# EAGLE design motori5 (EAGLE 5.04)
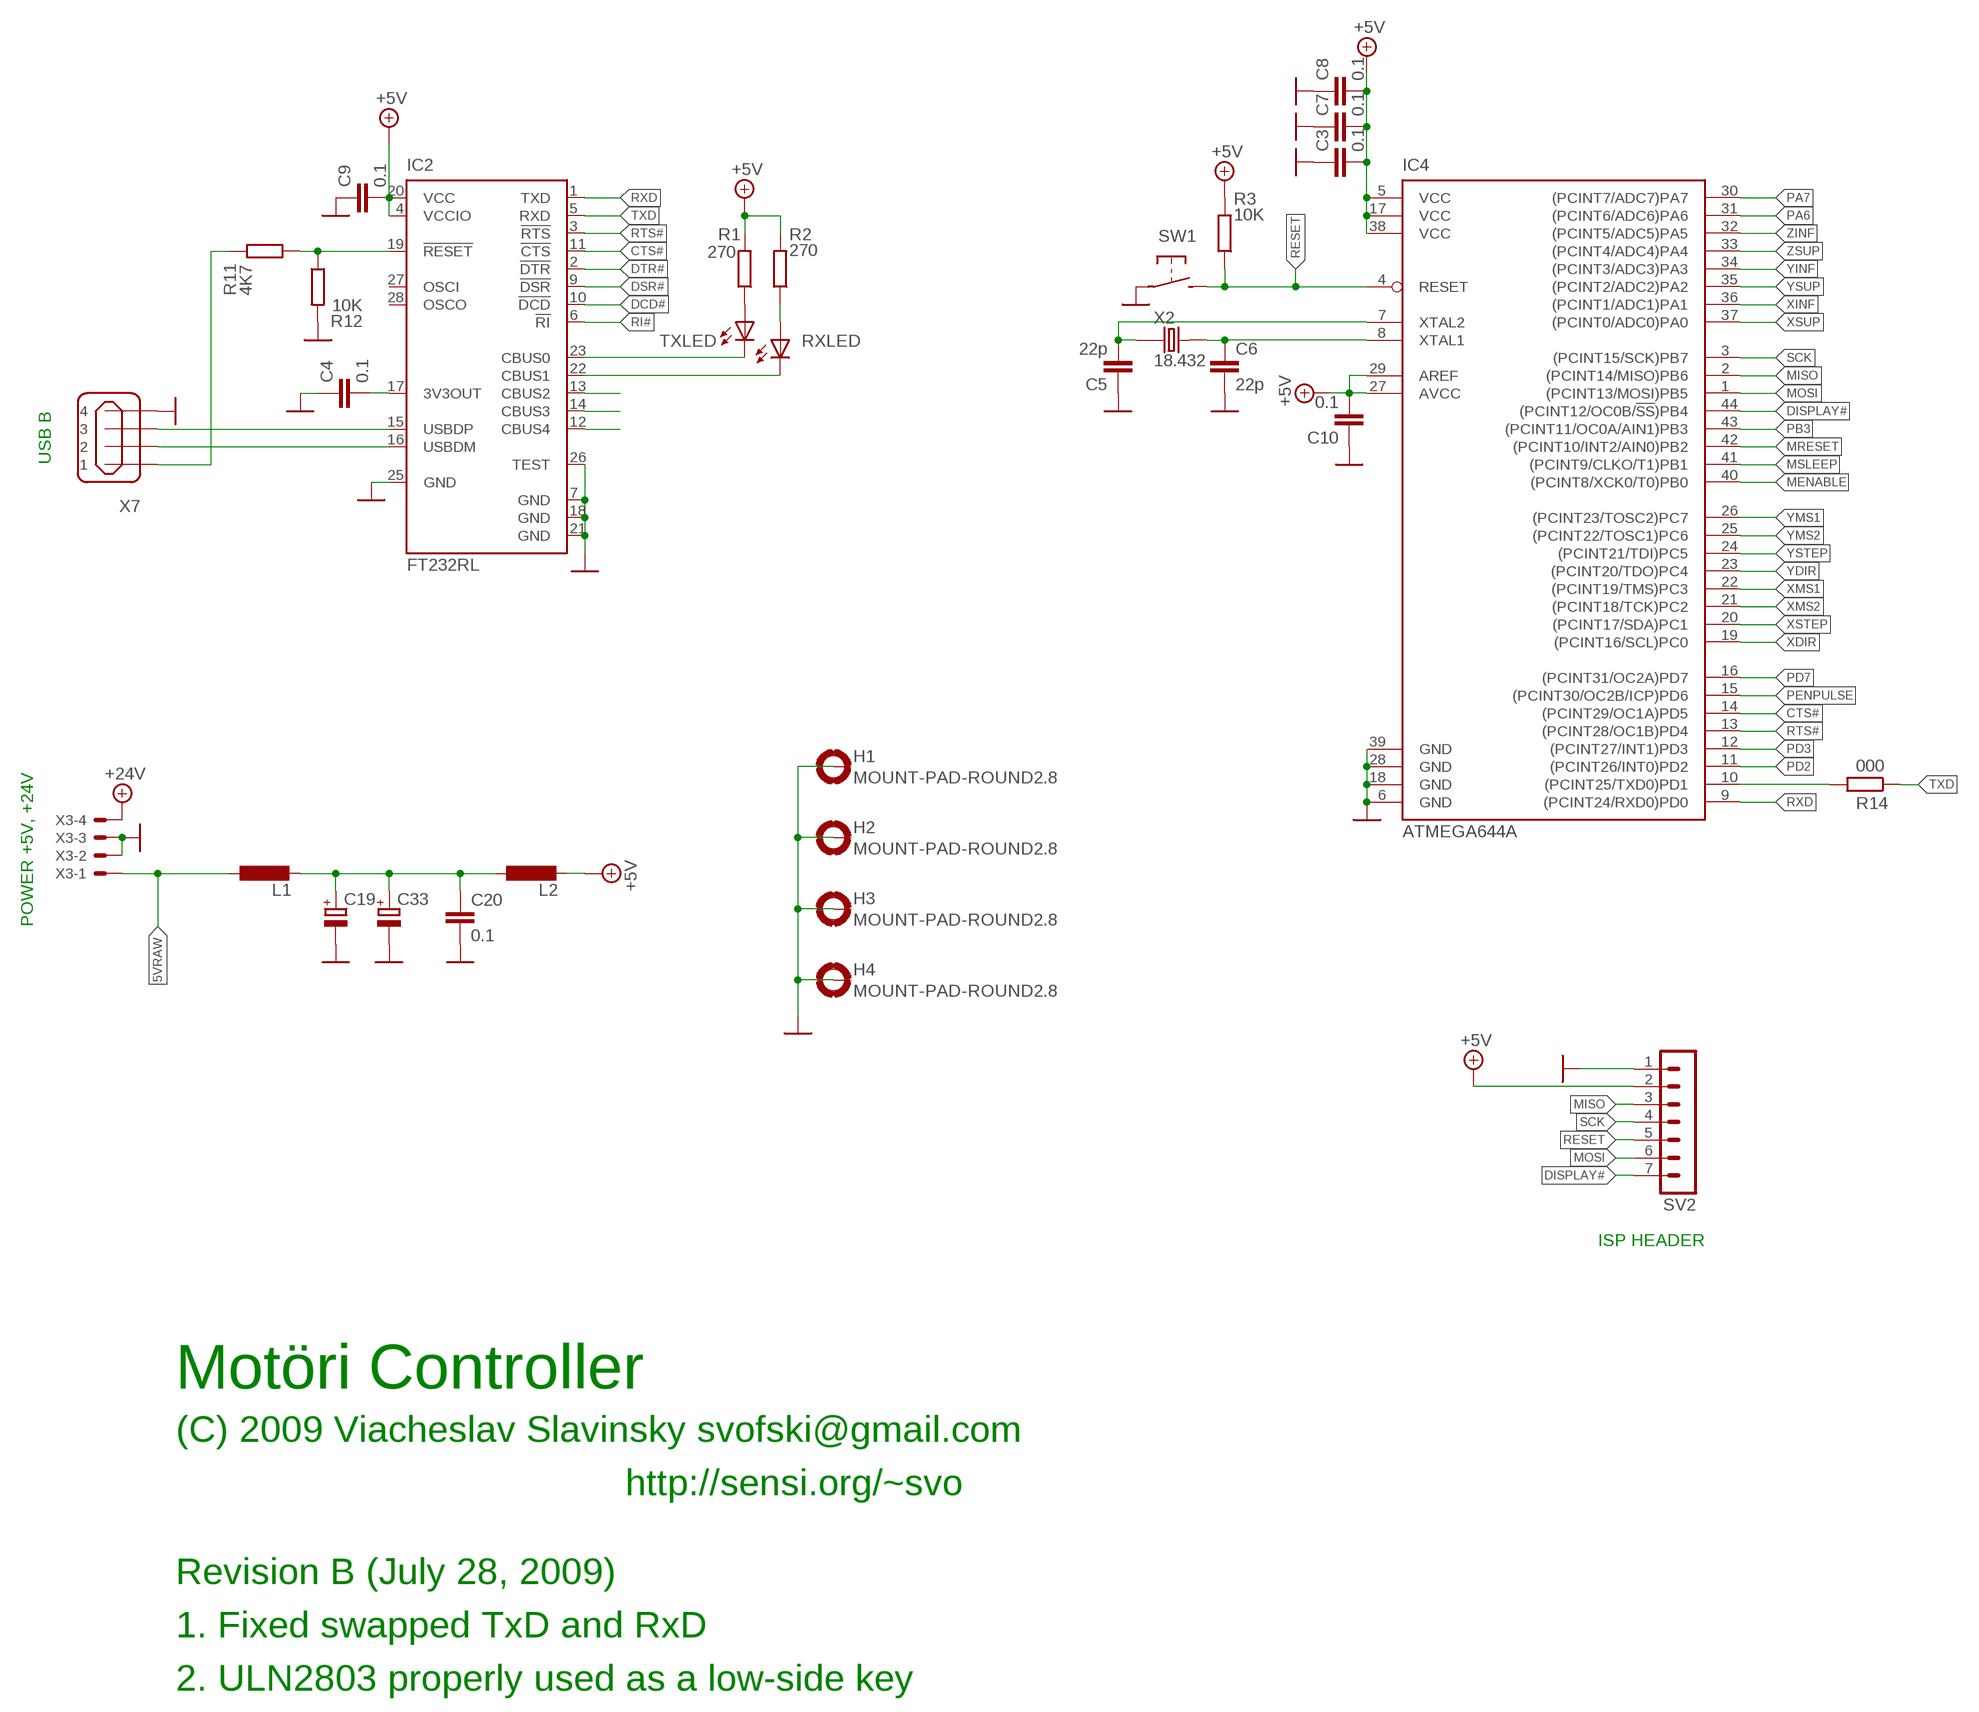
[diagram p0: schematic, sheet 1, part 1 of 2]
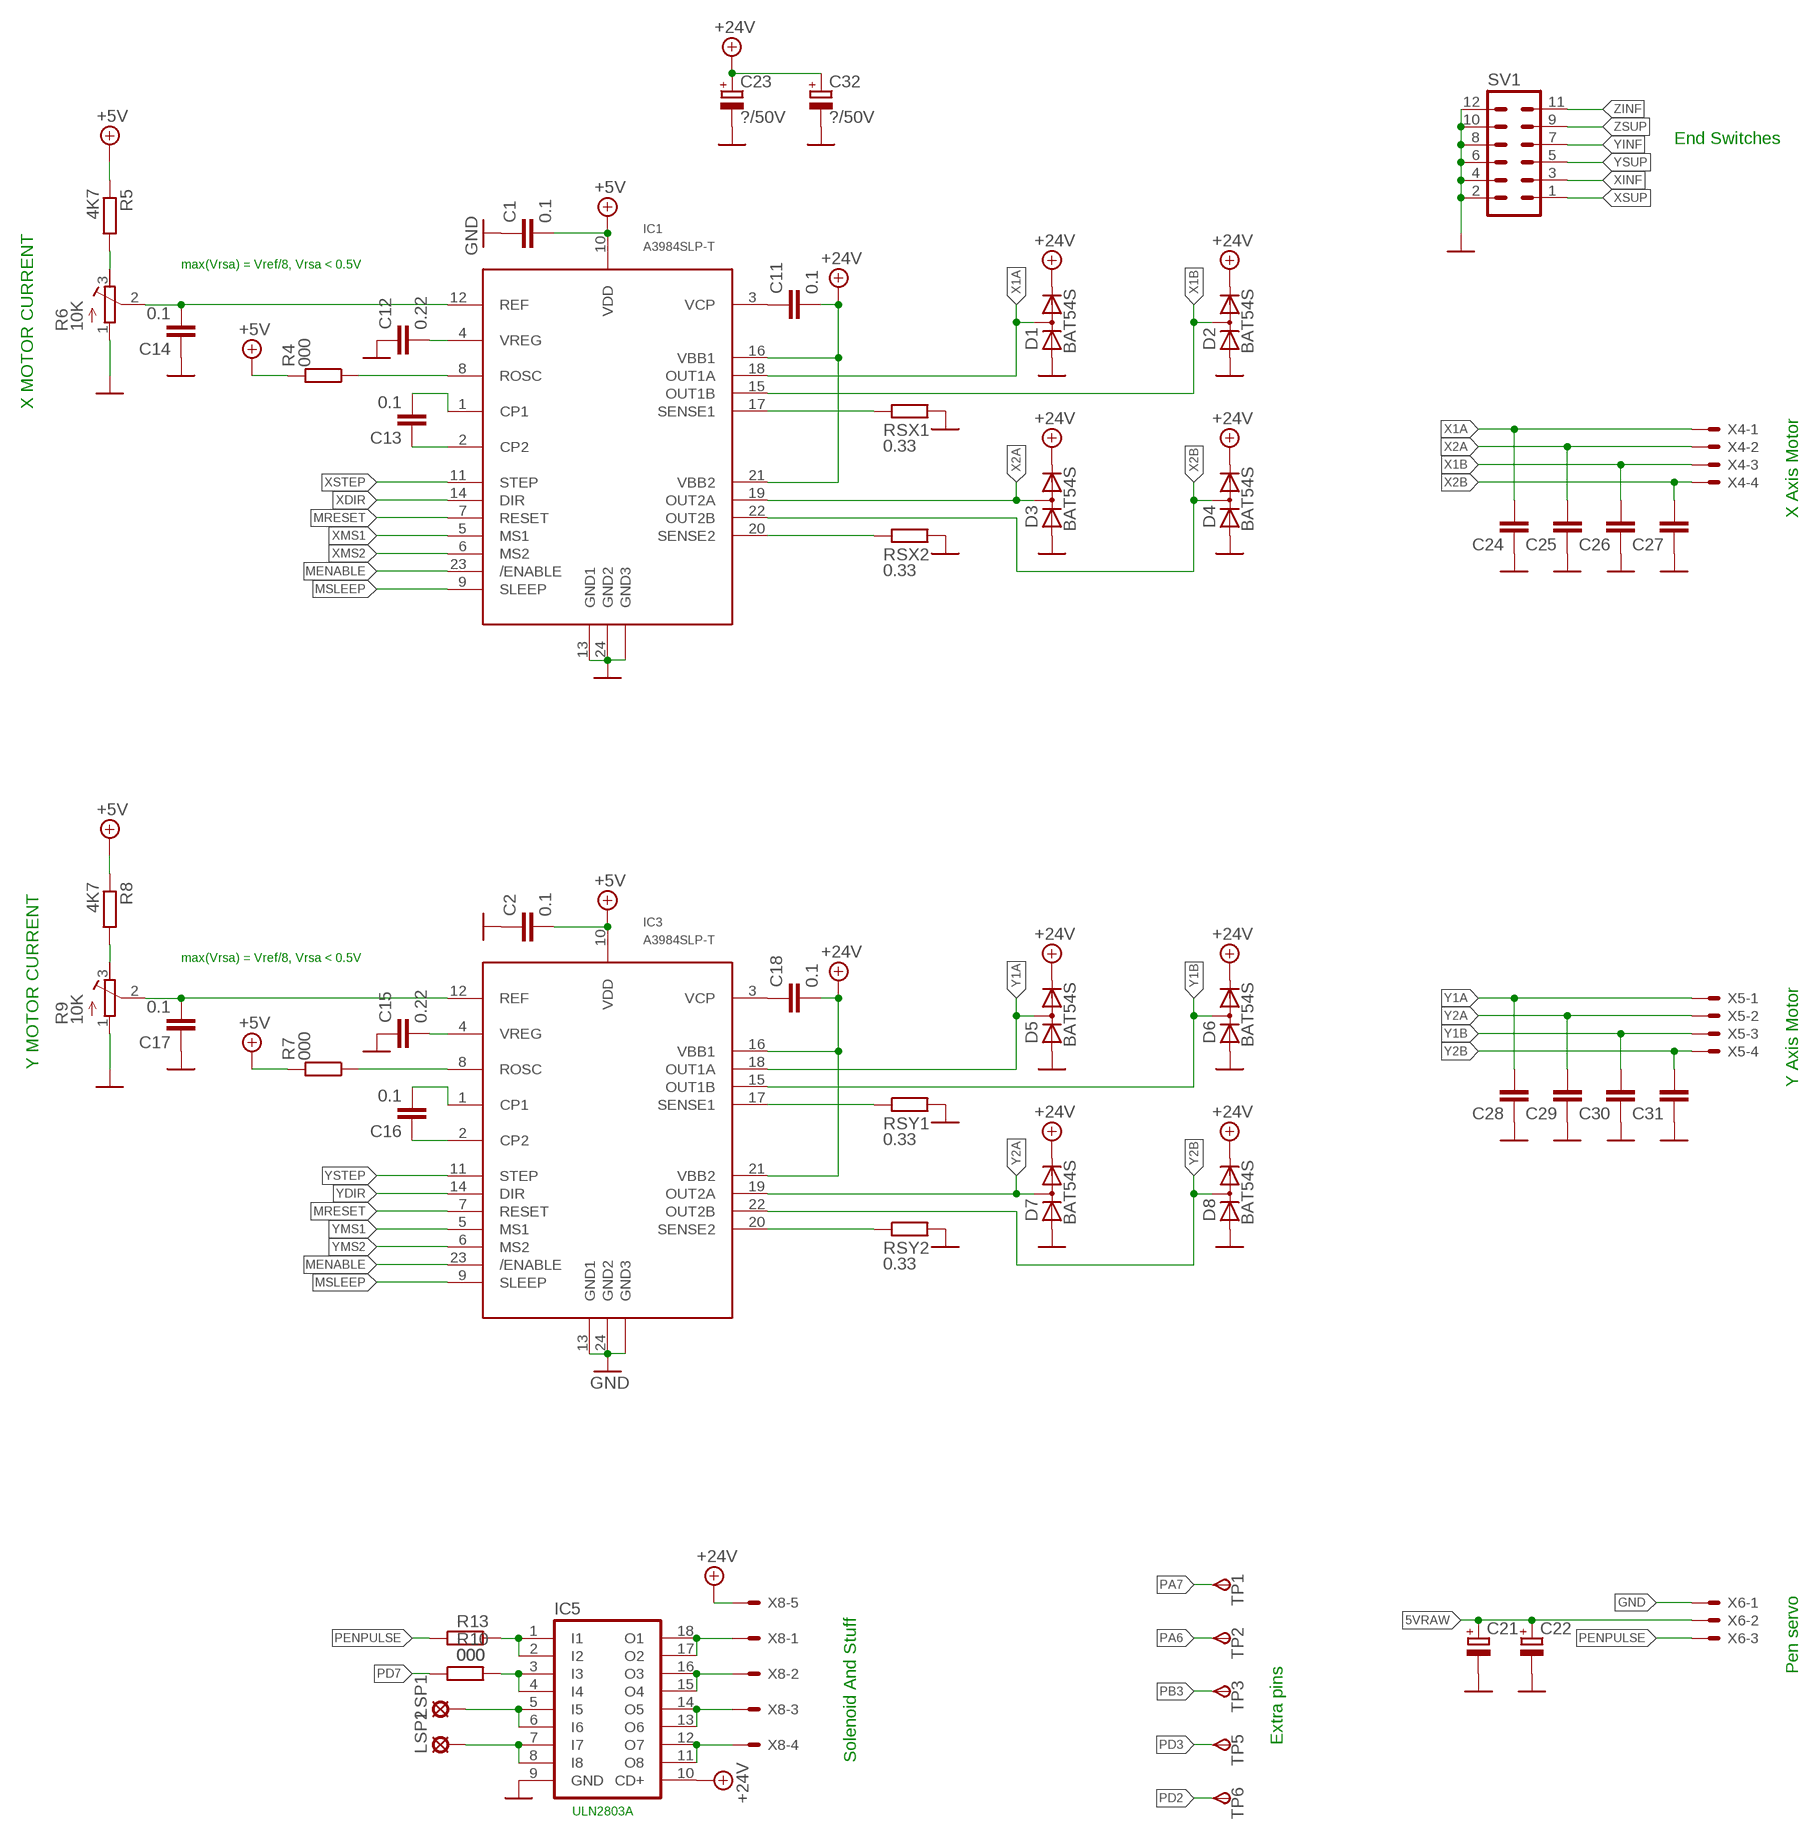
[diagram p1: schematic, sheet 1, part 2 of 2]

## Parts
C1  0.1  C-EUC0603K  [C0603K]
C2  0.1  C-EUC0603K  [C0603K]
C3  0.1  C-EUC0603K  [C0603K]
C4  0.1  C-EUC0603K  [C0603K]
C5  22p  C-EUC0805K  [C0805K]
C6  22p  C-EUC0805K  [C0805K]
C7  0.1  C-EUC0603K  [C0603K]
C8  0.1  C-EUC0603K  [C0603K]
C9  0.1  C-EUC0603K  [C0603K]
C10  0.1  C-EUC0603K  [C0603K]
C11  0.1  C-EUC0805K  [C0805K]
C12  0.22  C-EUC0805K  [C0805K]
C13  0.1  C-EUC0805K  [C0805K]
C14  0.1  C-EUC0603K  [C0603K]
C15  0.22  C-EUC0805K  [C0805K]
C16  0.1  C-EUC0805K  [C0805K]
C17  0.1  C-EUC0603K  [C0603K]
C18  0.1  C-EUC0805K  [C0805K]
C19  CPOL-EUC  [PANASONIC_C]
C20  0.1  C-EUC0603K  [C0603K]
C21  CPOL-EUC  [PANASONIC_C]
C22  CPOL-EUC  [PANASONIC_C]
C23  ?/50V  CPOL-EUTT5D10  [TT5D10]
C24  C-EUC0805K  [C0805K]
C25  C-EUC0805K  [C0805K]
C26  C-EUC0805K  [C0805K]
C27  C-EUC0805K  [C0805K]
C28  C-EUC0805K  [C0805K]
C29  C-EUC0805K  [C0805K]
C30  C-EUC0805K  [C0805K]
C31  C-EUC0805K  [C0805K]
C32  ?/50V  CPOL-EUTT5D10  [TT5D10]
C33  CPOL-EUC  [PANASONIC_C]
D1  BAT54S  DIODE_2CACA-SOT23  [SOT23]
D2  BAT54S  DIODE_2CACA-SOT23  [SOT23]
D3  BAT54S  DIODE_2CACA-SOT23  [SOT23]
D4  BAT54S  DIODE_2CACA-SOT23  [SOT23]
D5  BAT54S  DIODE_2CACA-SOT23  [SOT23]
D6  BAT54S  DIODE_2CACA-SOT23  [SOT23]
D7  BAT54S  DIODE_2CACA-SOT23  [SOT23]
D8  BAT54S  DIODE_2CACA-SOT23  [SOT23]
H1  MOUNT-PAD-ROUND2.8  [2,8-PAD]
H2  MOUNT-PAD-ROUND2.8  [2,8-PAD]
H3  MOUNT-PAD-ROUND2.8  [2,8-PAD]
H4  MOUNT-PAD-ROUND2.8  [2,8-PAD]
IC1  A3984SLP-T  [ETSSOP24]
IC2  FT232RL  [SSOP28]
IC3  A3984SLP-T  [ETSSOP24]
IC4  ATMEGA644A  [TQFP44]
IC5  ULN2803A  [DIL18]
L1  L-EUL5650M  [L5650M]
L2  L-EUL5650M  [L5650M]
LSP1  LSP10  [LSP10]
LSP2  LSP10  [LSP10]
R1  270  R-EU_R0603  [R0603]
R2  270  R-EU_R0603  [R0603]
R3  10K  R-EU_R0805  [R0805]
R4  000  R-EU_R0805  [R0805]
R5  4K7  R-EU_R0805  [R0805]
R6  10K  R-TRIMMCVR42A  [RTRIMCVR42A]
R7  000  R-EU_R0805  [R0805]
R8  4K7  R-EU_R0805  [R0805]
R9  10K  R-TRIMMCVR42A  [RTRIMCVR42A]
R10  000  R-EU_R0805  [R0805]
R11  4K7  R-EU_R0805  [R0805]
R12  10K  R-EU_R0805  [R0805]
R13  000  R-EU_R0805  [R0805]
R14  000  R-EU_R0805  [R0805]
RSX1  0.33  R-EU_R2010  [R2010]
RSX2  0.33  R-EU_R2010  [R2010]
RSY1  0.33  R-EU_R2010  [R2010]
RSY2  0.33  R-EU_R2010  [R2010]
RXLED  LEDCHIPLED_0603  [CHIPLED_0603]
SV1  MA06-2  [MA06-2]
SV2  MA07-1  [MA07-1]
SW1  BUTTON-IT_1181  [SW_IT1181]
TP1  TPSTP10SQ  [TP10SQ]
TP2  TPSTP10SQ  [TP10SQ]
TP3  TPSB2,54  [B2,54]
TP5  TPSTP10SQ  [TP10SQ]
TP6  TPSTP10SQ  [TP10SQ]
TXLED  LEDCHIPLED_1206  [CHIPLED_1206]
X2  18.432  KX-12B  [GEYER_KX-12B]
X3  22-23-2041  [22-23-2041]
X4  22-23-2041  [22-23-2041]
X5  22-23-2041  [22-23-2041]
X6  22-23-2031  [22-23-2031]
X7  MINI-USB_SHIELD4P-85-32004-10X  [85-32004-10X]
X8  22-23-2051  [22-23-2051]

## Nets
5VRAW: C21.+ C22.+ L1.1 X3.1 X6.2
+5V: C1.2 C2.2 C3.2 C7.2 C8.2 C9.2 C10.2 IC1.10(VDD) IC2.4(VCCIO) IC2.20(VCC) IC3.10(VDD) IC4.5(VCC) IC4.17(VCC) IC4.27(AVCC) IC4.29(AREF) IC4.38(VCC) L2.2 R1.2 R2.2 R3.2 R4.2 R5.1 R7.2 R8.1 SV2.2
+24V: C11.2 C18.2 C23.+ C32.+ D1.2(C) D2.2(C) D3.2(C) D4.2(C) D5.2(C) D6.2(C) D7.2(C) D8.2(C) IC1.16(VBB1) IC1.21(VBB2) IC3.16(VBB1) IC3.21(VBB2) IC5.10(CD+) X3.4 X8.5
CTS#: IC2.11(!CTS) IC4.14((PCINT29/OC1A)PD5)
DCD#: IC2.10(!DCD)
DISPLAY#: IC4.44((PCINT12/OC0B/!SS!)PB4) SV2.7
DSR#: IC2.9(!DSR)
DTR#: IC2.2(!DTR)
FTDIRESET: IC2.19(!RESET) R11.1 R12.1
GND: C1.1 C2.1 C3.1 C4.1 C5.1 C6.2 C7.1 C8.1 C9.1 C10.1 C12.1 C14.1 C15.1 C17.1 C19.- C20.2 C21.- C22.- C23.- C24.1 C25.1 C26.1 C27.1 C28.1 C29.1 C30.1 C31.1 C32.- C33.- D1.1(A) D2.1(A) D3.1(A) D4.1(A) D5.1(A) D6.1(A) D7.1(A) D8.1(A) H1.B2,8(MOUNT) H2.B2,8(MOUNT) H3.B2,8(MOUNT) H4.B2,8(MOUNT) IC1.13(GND1) IC1.24(GND2) IC1.THERMALPAD(GND3) IC2.7(GND) IC2.18(GND) IC2.21(GND) IC2.25(GND) IC2.26(TEST) IC3.13(GND1) IC3.24(GND2) IC3.THERMALPAD(GND3) IC4.6(GND) IC4.18(GND) IC4.28(GND) IC4.39(GND) IC5.9(GND) R6.1(E) R9.1(E) R12.2 RSX1.2 RSX2.2 RSY1.2 RSY2.2 SV1.2 SV1.4 SV1.6 SV1.8 SV1.10 SV1.12 SV2.1 SW1.P$1(P1) X3.2 X3.3 X6.1 X7.4
MENABLE: IC1.23(/ENABLE) IC3.23(/ENABLE) IC4.40((PCINT8/XCK0/T0)PB0)
MISO: IC4.2((PCINT14/MISO)PB6) SV2.3
MOSI: IC4.1((PCINT13/MOSI)PB5) SV2.6
MRESET: IC1.7(RESET) IC3.7(RESET) IC4.42((PCINT10/INT2/AIN0)PB2)
MSLEEP: IC1.9(SLEEP) IC3.9(SLEEP) IC4.41((PCINT9/CLKO/T1)PB1)
N$1: IC2.22(CBUS1) RXLED.C
N$2: R1.1 TXLED.A
N$3: R2.1 RXLED.A
N$4: C6.1 IC4.8(XTAL1) X2.P$2
N$7: C4.2 IC2.17(3V3OUT)
N$8: C5.2 IC4.7(XTAL2) X2.P$1
N$10: C11.1 IC1.3(VCP)
N$11: R5.2 R6.3(A)
N$12: C12.2 IC1.4(VREG)
N$13: IC2.23(CBUS0) TXLED.C
N$14: IC1.8(ROSC) R4.1
N$15: C13.1 IC1.2(CP2)
N$16: C13.2 IC1.1(CP1)
N$17: IC4.10((PCINT25/TXD0)PD1) R14.2
N$18: IC1.17(SENSE1) RSX1.1
N$19: IC1.20(SENSE2) RSX2.1
N$20: C15.2 IC3.4(VREG)
N$21: IC3.8(ROSC) R7.1
N$22: C16.1 IC3.2(CP2)
N$23: C16.2 IC3.1(CP1)
N$25: R8.2 R9.3(A)
N$26: IC3.17(SENSE1) RSY1.1
N$27: IC3.20(SENSE2) RSY2.1
N$28: C18.1 IC3.3(VCP)
N$29: C19.+ C20.1 C33.+ L1.2 L2.1
N$41: IC5.17(O2) IC5.18(O1) X8.1
N$42: R11.2 X7.1
N$43: IC5.15(O4) IC5.16(O3) X8.2
N$44: IC5.13(O6) IC5.14(O5) X8.3
N$45: IC5.11(O8) IC5.12(O7) X8.4
N$46: IC5.1(I1) IC5.2(I2) R13.2
N$47: IC5.3(I3) IC5.4(I4) R10.2
N$48: IC5.5(I5) IC5.6(I6) LSP1.MP
N$49: IC5.7(I7) IC5.8(I8) LSP2.MP
PA6: IC4.31((PCINT6/ADC6)PA6) TP2.TP(PP)
PA7: IC4.30((PCINT7/ADC7)PA7) TP1.TP(PP)
PB3: IC4.43((PCINT11/OC0A/AIN1)PB3) TP3.PP
PD2: IC4.11((PCINT26/INT0)PD2) TP6.TP(PP)
PD3: IC4.12((PCINT27/INT1)PD3) TP5.TP(PP)
PD7: IC4.16((PCINT31/OC2A)PD7) R10.1
PENPULSE: IC4.15((PCINT30/OC2B/ICP)PD6) R13.1 X6.3
PWREN#: IC2.14(CBUS3)
RESET: IC4.4(RESET) R3.1 SV2.5 SW1.P$2(P2)
RI#: IC2.6(!RI)
RTS#: IC2.3(!RTS) IC4.13((PCINT28/OC1B)PD4)
RXD: IC2.1(TXD) IC4.9((PCINT24/RXD0)PD0)
SCK: IC4.3((PCINT15/SCK)PB7) SV2.4
SLEEP#: IC2.12(CBUS4)
TXD: IC2.5(RXD) R14.1
TXDEN: IC2.13(CBUS2)
U+: IC2.15(USBDP) X7.3
U-: IC2.16(USBDM) X7.2
VREFX: C14.2 IC1.12(REF) R6.2(S)
VREFY: C17.2 IC3.12(REF) R9.2(S)
X1A: C24.2 D1.3(AC) IC1.18(OUT1A) X4.1
X1B: C26.2 D2.3(AC) IC1.15(OUT1B) X4.3
X2A: C25.2 D3.3(AC) IC1.19(OUT2A) X4.2
X2B: C27.2 D4.3(AC) IC1.22(OUT2B) X4.4
XDIR: IC1.14(DIR) IC4.19((PCINT16/SCL)PC0)
XINF: IC4.36((PCINT1/ADC1)PA1) SV1.3
XMS1: IC1.5(MS1) IC4.22((PCINT19/TMS)PC3)
XMS2: IC1.6(MS2) IC4.21((PCINT18/TCK)PC2)
XSTEP: IC1.11(STEP) IC4.20((PCINT17/SDA)PC1)
XSUP: IC4.37((PCINT0/ADC0)PA0) SV1.1
Y1A: C28.2 D5.3(AC) IC3.18(OUT1A) X5.1
Y1B: C30.2 D6.3(AC) IC3.15(OUT1B) X5.3
Y2A: C29.2 D7.3(AC) IC3.19(OUT2A) X5.2
Y2B: C31.2 D8.3(AC) IC3.22(OUT2B) X5.4
YDIR: IC3.14(DIR) IC4.23((PCINT20/TDO)PC4)
YINF: IC4.34((PCINT3/ADC3)PA3) SV1.7
YMS1: IC3.5(MS1) IC4.26((PCINT23/TOSC2)PC7)
YMS2: IC3.6(MS2) IC4.25((PCINT22/TOSC1)PC6)
YSTEP: IC3.11(STEP) IC4.24((PCINT21/TDI)PC5)
YSUP: IC4.35((PCINT2/ADC2)PA2) SV1.5
ZINF: IC4.32((PCINT5/ADC5)PA5) SV1.11
ZSUP: IC4.33((PCINT4/ADC4)PA4) SV1.9
Unconnected: IC2.27(OSCI) IC2.28(OSCO) X7.M1(S1) X7.M2(S2)

## Notes on the sheet
- End Switches
- X MOTOR CURRENT
- max(Vrsa) = Vref/8, Vrsa < 0.5V
- X Axis Motor
- USB B
- max(Vrsa) = Vref/8, Vrsa < 0.5V
- POWER +5V, +24V
- Y MOTOR CURRENT
- Y Axis Motor
- ISP HEADER
- Motöri Controller
- (C) 2009 Viacheslav Slavinsky svofski@gmail.com
- http://sensi.org/~svo
- Pen servo
- Revision B (July 28, 2009)
- 1. Fixed swapped TxD and RxD | Extra pins
- Solenoid And Stuff
- 2. ULN2803 properly used as a low-side key
- ULN2803A

## Library data of the parts
C1-C18 C20 C24-C31 = rcl:C-EU: CAPACITOR, European symbol
C19 C21-C23 C32 C33 = rcl:CPOL-EU: POLARIZED CAPACITOR, European symbol
D1-D8 = diode:DIODE_2CACA-: 2 Diodes - Cathode-Anode|Cathode-Anode
H1-H4 = holes:MOUNT-PAD-ROUND: MOUNTING PAD, round
IC1 IC3 = 0-allegro-a3984:A3984*: DMOS Microstepping Driver with Translator
IC2 = ftdichip:FT232R: Source: http://www.ftdichip.com/Documents/DataSheets/DS_FT232R_v104.pdf
IC4 = atmel:ATMEGA644: 8-bit Microcontroller with 64K Bytes In-System Programmable Flash Source: http://www.atmel.com/dyn/resources/prod_documents/doc2593.pdf
IC5 = uln-udn:ULN2803A: DRIVER ARRAY
L1 L2 = rcl:L-EU: INDUCTOR, European symbol
LSP1 LSP2 = solpad:LSP10: SOLDER PAD drill 1.0 mm, distributor Buerklin, 12H555
R1-R5 R7 R8 R10-R14 RSX1 RSX2 RSY1 RSY2 = rcl:R-EU_: RESISTOR, European symbol
R6 R9 = rcl:R-TRIMM: Trimm resistor
RXLED TXLED = led:LED: LED OSRAM: - CHIPLED LG R971, LG N971, LY N971, LG Q971, LY Q971, LO R971, LY R971 LH N974, LH R974 LS Q976, LO Q976, LY Q976 LO Q996 - Hyper CHIPLED LW Q18S LB Q993, LB Q99A, LB R99A - SideLED LS A670, LO A670, LY A670, LG A670, LP A670 LB A673, LV A673, LT A673, LW A673 LH A674 LY A675 LS A676, LA A676, LO A676, LY A676, LW A676 LS A679, LY A679, LG A679 - Hyper Micro SIDELED® LS Y876, LA Y876, LO Y876, LY Y876 LT Y87S - SmartLED LW L88C, LW L88S LB L89C, LB L89S, LG L890 LS L89K, LO L89K, LY L89K LS L896, LA L896, LO L896, LY L896 - TOPLED LS T670, LO T670, LY T670, LG T670, LP T670 LSG T670, LSP T670, LSY T670, LOP T670, LYG T670 LG T671, LOG T671, LSG T671 LB T673, LV T673, LT T673, LW T673 LH T674 LS T676, LA T676, LO T676, LY T676, LB T676, LH T676, LSB T676, LW T676 LB T67C, LV T67C, LT T67C, LS T67K, LO T67K, LY T67K, LW E67C LS E67B, LA E67B, LO E67B, LY E67B, LB E67C, LV E67C, LT E67C LW T67C LS T679, LY T679, LG T679 LS T770, LO T770, LY T770, LG T770, LP T770 LB T773, LV T773, LT T773, LW T773 LH T774 LS E675, LA E675, LY E675, LS T675 LS T776, LA T776, LO T776, LY T776, LB T776 LHGB T686 LT T68C, LB T68C - Hyper Mini TOPLED® LB M676 - Mini TOPLED Santana® LG M470 LS M47K, LO M47K, LY M47K Source: http://www.osram.convergy.de LUXEON: - LUMILED® LXK2-PW12-R00, LXK2-PW12-S00, LXK2-PW14-U00, LXK2-PW14-V00 LXK2-PM12-R00, LXK2-PM12-S00, LXK2-PM14-U00 LXK2-PE12-Q00, LXK2-PE12-R00, LXK2-PE12-S00, LXK2-PE14-T00, LXK2-PE14-U00 LXK2-PB12-K00, LXK2-PB12-L00, LXK2-PB12-M00, LXK2-PB14-N00, LXK2-PB14-P00, LXK2-PB14-Q00 LXK2-PR12-L00, LXK2-PR12-M00, LXK2-PR14-Q00, LXK2-PR14-R00 LXK2-PD12-Q00, LXK2-PD12-R00, LXK2-PD12-S00 LXK2-PH12-R00, LXK2-PH12-S00 LXK2-PL12-P00, LXK2-PL12-Q00, LXK2-PL12-R00 Source: www.luxeon.com KINGBRIGHT: KA-3528ASYC Source: www.kingbright.com
SV1 = con-lstb:MA06-2: PIN HEADER
SV2 = con-lstb:MA07-1: PIN HEADER
SW1 = 0-svo:BUTTON-IT_1181
TP1-TP3 TP5 TP6 = 0-svo:TPS: TEST PIN
X2 = 0-svo:KX-12B: GEYER SMD Quartz Crystals
X3-X5 = con-molex:22-23-2041: .100" (2.54mm) Center Header - 4 Pin
X6 = con-molex:22-23-2031: .100" (2.54mm) Center Header - 3 Pin
X7 = con-cypressindustries:MINI-USB_SHIELD4P-: MINI USB 4 Pol. Source: www.cypressindustries.com
X8 = con-molex:22-23-2051: .100" (2.54mm) Center Header - 5 Pin

## Board
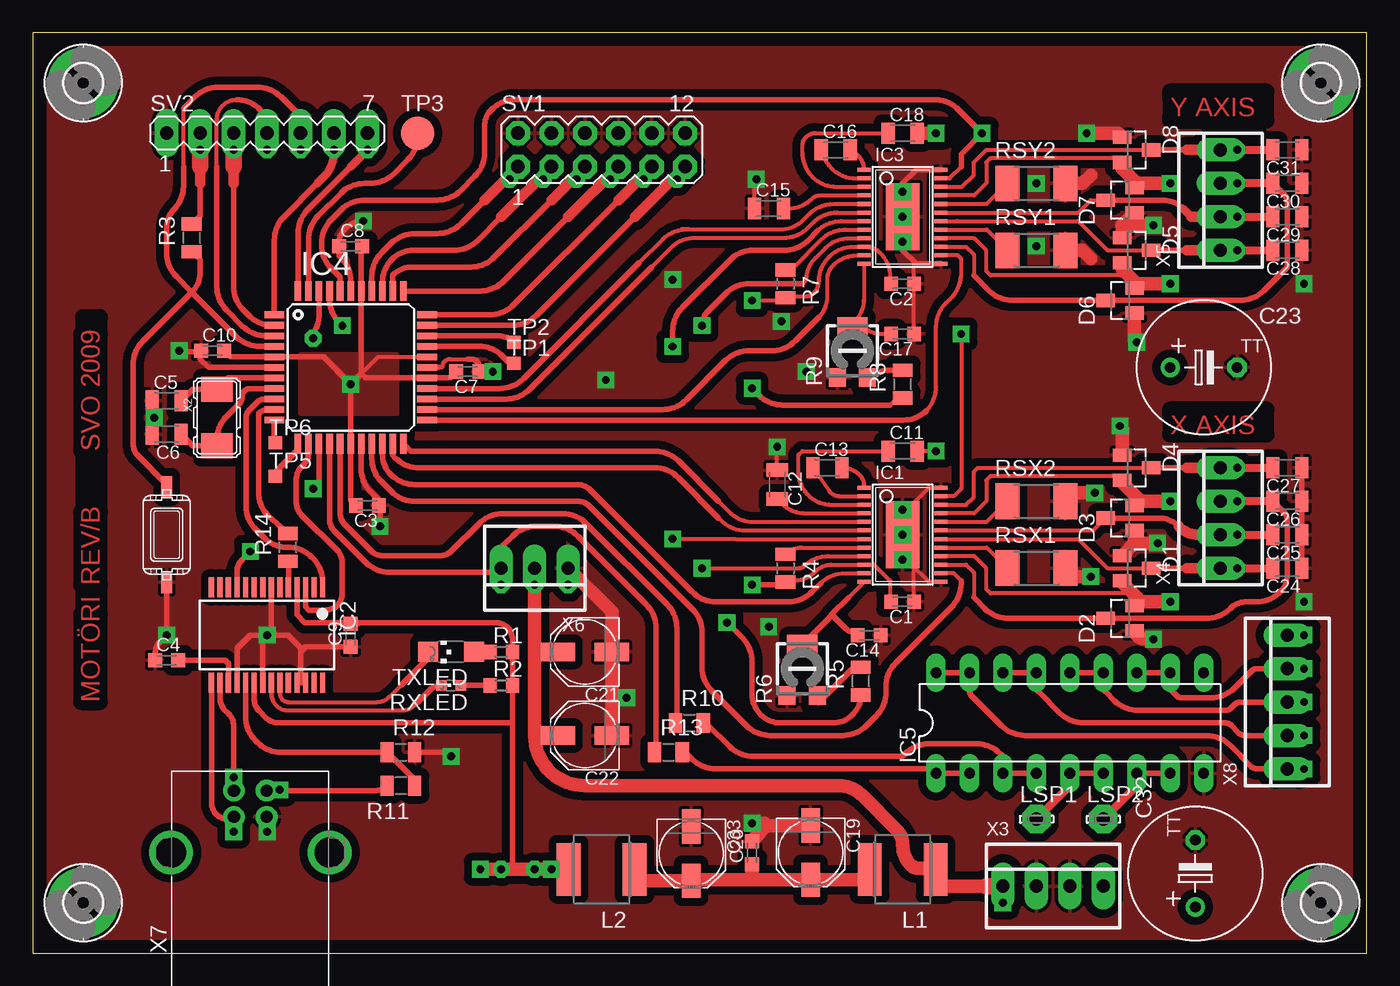
[diagram p2: board, top side]
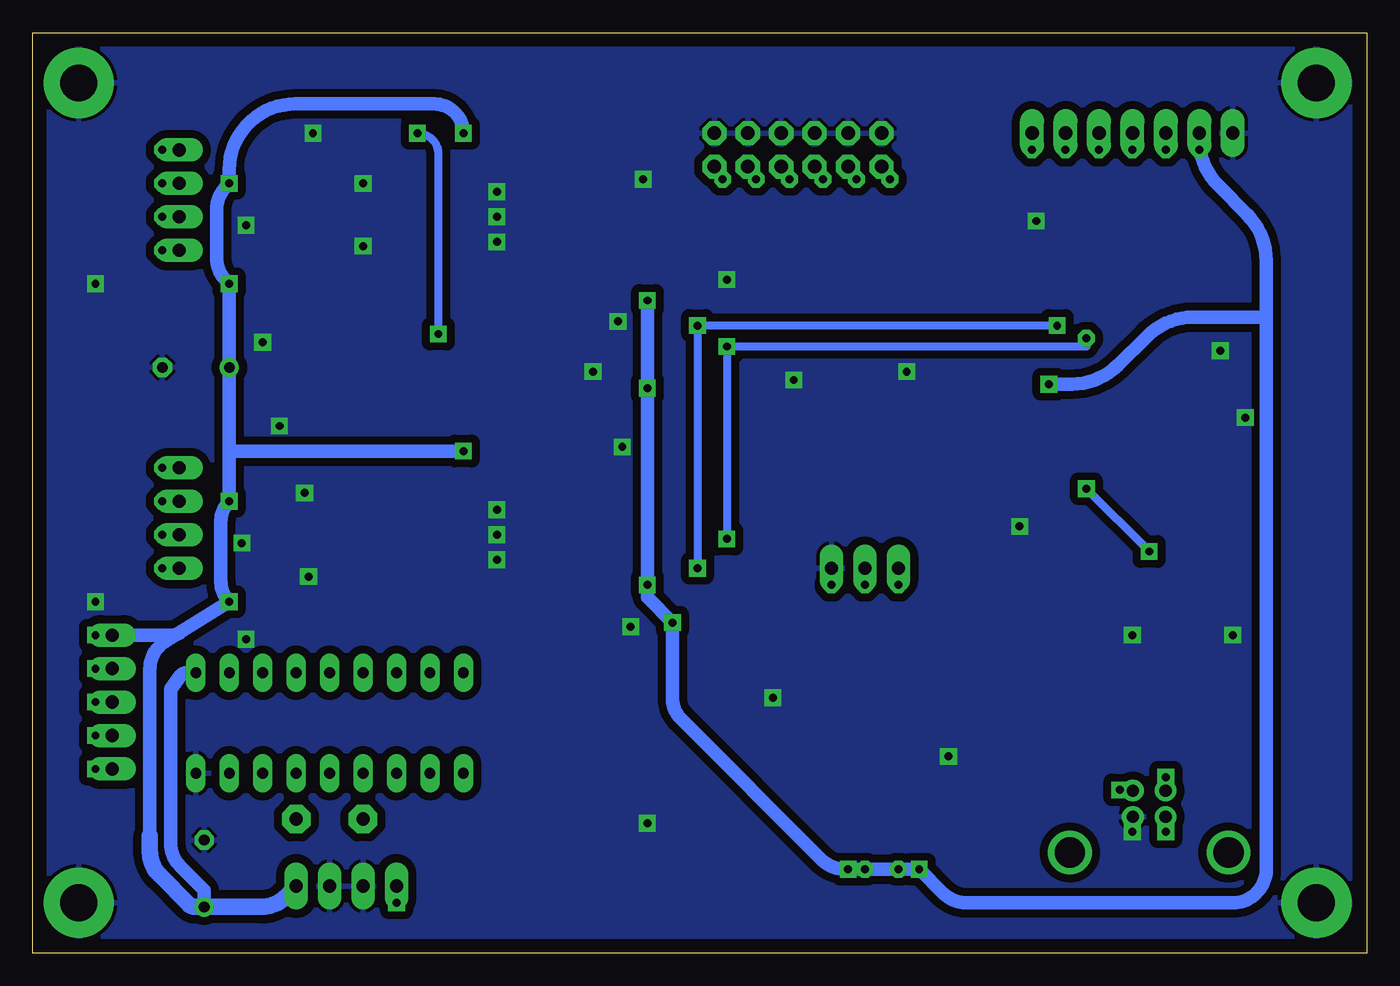
[diagram p3: board, bottom side, seen from below]

Size 101.27 x 69.84 mm. Coordinates in mm from the lower left corner, seen from the top.
Outline: 0,0 101.27,0 101.27,69.84 0,69.84 0,0
Copper layers (1*16): Top 0.035mm / dielectric 1.5mm / Bottom 0.035mm
Design rules "default *": minimum track width 10mil, minimum drill 24mil, track to track 8mil, track to pad 8mil, pad to pad 8mil, via to via 8mil, smd to smd 8mil, copper to edge 40mil, drill to drill 8mil, minimum pad ring 10mil, minimum via ring 8mil, stop-mask expansion 4mil, vias tented up to drill 0mil, thermal gap 10mil
tRestrict: area 86.4,39.4 to 93.7,41.3; area 86.4,63.2 to 93.7,65.4; area 3.8,19.1 to 5.1,48.3; area 61,44.4 to 63.5,45.7; area 57.2,20.3 to 59.7,21.6

### Footprints (pad centres in the part's own frame; a part is rotated, then mirrored left to right if it is on the bottom)
C0603K = smd 1.05 x 1.08: 1 -0.875,0; 2 0.875,0
C0805K = smd 1 x 1.6: 1 -1.1,0; 2 1.1,0
PANASONIC_C = smd 2.6 x 1.4: + 2.05,0; - -2.05,0
TT5D10 = drill 0.813 round: + -2.54,0 | drill 0.813 octagon: - 2.54,0
SOT23 = smd 1 x 1.4: 1 -0.95,-1.1; 2 0.95,-1.1; 3 0,1.1
2,8-PAD = drill 2.8 pad 5.334 round: B2,8 0,0
ETSSOP24 = smd 0.305 x 0.991: 1 -3.575,-2.918; 2 -2.925,-2.918; 3 -2.275,-2.918; 4 -1.625,-2.918; 5 -0.975,-2.918; 6 -0.325,-2.918; 7 0.325,-2.918; 8 0.975,-2.918; 9 1.625,-2.918; 10 2.275,-2.918; 11 2.925,-2.918; 12 3.575,-2.918; 13 3.575,2.918; 14 2.925,2.918; 15 2.275,2.918; 16 1.625,2.918; 17 0.975,2.918; 18 0.325,2.918; 19 -0.325,2.918; 20 -0.975,2.918; 21 -1.625,2.918; 22 -2.275,2.918; 23 -2.925,2.918; 24 -3.575,2.918 | smd 5.08 x 2.54: THERMALPAD 0,0
SSOP28 = smd 0.4 x 1.5: 1 -4.225,-3.625; 2 -3.575,-3.625; 3 -2.925,-3.625; 4 -2.275,-3.625; 5 -1.625,-3.625; 6 -0.975,-3.625; 7 -0.325,-3.625; 8 0.325,-3.625; 9 0.975,-3.625; 10 1.625,-3.625; 11 2.275,-3.625; 12 2.925,-3.625; 13 3.575,-3.625; 14 4.225,-3.625; 15 4.225,3.625; 16 3.575,3.625; 17 2.925,3.625; 18 2.275,3.625; 19 1.625,3.625; 20 0.975,3.625; 21 0.325,3.625; 22 -0.325,3.625; 23 -0.975,3.625; 24 -1.625,3.625; 25 -2.275,3.625; 26 -2.925,3.625; 27 -3.575,3.625; 28 -4.225,3.625
TQFP44 = smd 1.5 x 0.5: 1 -5.8,4; 2 -5.8,3.2; 3 -5.8,2.4; 4 -5.8,1.6; 5 -5.8,0.8; 6 -5.8,0; 7 -5.8,-0.8; 8 -5.8,-1.6; 9 -5.8,-2.4; 10 -5.8,-3.2; 11 -5.8,-4; 23 5.8,-4; 24 5.8,-3.2; 25 5.8,-2.4; 26 5.8,-1.6; 27 5.8,-0.8; 28 5.8,0; 29 5.8,0.8; 30 5.8,1.6; 31 5.8,2.4; 32 5.8,3.2; 33 5.8,4 | smd 0.5 x 1.5: 12 -4,-5.8; 13 -3.2,-5.8; 14 -2.4,-5.8; 15 -1.6,-5.8; 16 -0.8,-5.8; 17 0,-5.8; 18 0.8,-5.8; 19 1.6,-5.8; 20 2.4,-5.8; 21 3.2,-5.8; 22 4,-5.8; 34 4,5.8; 35 3.2,5.8; 36 2.4,5.8; 37 1.6,5.8; 38 0.8,5.8; 39 0,5.8; 40 -0.8,5.8; 41 -1.6,5.8; 42 -2.4,5.8; 43 -3.2,5.8; 44 -4,5.8
DIL18 = drill 0.813 long: 1 -10.16,-3.81; 2 -7.62,-3.81; 3 -5.08,-3.81; 4 -2.54,-3.81; 5 0,-3.81; 6 2.54,-3.81; 7 5.08,-3.81; 8 7.62,-3.81; 9 10.16,-3.81; 10 10.16,3.81; 11 7.62,3.81; 12 5.08,3.81; 13 2.54,3.81; 14 0,3.81; 15 -2.54,3.81; 16 -5.08,3.81; 17 -7.62,3.81; 18 -10.16,3.81
L5650M = smd 1.8 x 4: 1 -2.5,0; 2 2.5,0
LSP10 = drill 1.016 pad 2.159 octagon: MP 0,0
R0603 = smd 1 x 1.1: 1 -0.85,0; 2 0.85,0
R0805 = smd 1 x 1.5: 1 -1.05,0; 2 1.05,0
RTRIMCVR42A = smd 1.3 x 1.4: 1 -1.15,-2.05; 3 1.15,-2.05 | smd 2.3 x 1.5: 2 0,1.8
R2010 = smd 1.8 x 2.7: 1 -2.2,0; 2 2.2,0
CHIPLED_0603 = smd 0.8 x 0.8: A 0,-0.75; C 0,0.75
MA06-2 = drill 1.016 octagon: 1 -6.35,-1.27; 2 -6.35,1.27; 3 -3.81,-1.27; 4 -3.81,1.27; 5 -1.27,-1.27; 6 -1.27,1.27; 7 1.27,-1.27; 8 1.27,1.27; 9 3.81,-1.27; 10 3.81,1.27; 11 6.35,-1.27; 12 6.35,1.27
MA07-1 = drill 1.016 long: 1 -7.62,0; 2 -5.08,0; 3 -2.54,0; 4 0,0; 5 2.54,0; 6 5.08,0; 7 7.62,0
SW_IT1181 = smd 1.676 x 0.813: P$1 -3.61,0; P$2 3.61,0
TP10SQ = smd 1 x 1: TP 0,0
B2,54 = smd 2.54 x 2.54: PP 0,0
CHIPLED_1206 = smd 1.5 x 1.5: A 0,-1.75; C 0,1.75
GEYER_KX-12B = smd 1.9 x 2.4: P$1 -2.14,0; P$2 2.14,0
22-23-2041 = drill 1 long: 1 -3.81,0; 2 -1.27,0; 3 1.27,0; 4 3.81,0
22-23-2031 = drill 1 long: 1 -2.54,0; 2 0,0; 3 2.54,0
85-32004-10X = drill 0.92 pad 1.27 round: 1 4.71,-1.25; 2 4.71,1.25; 3 2.71,1.25; 4 2.71,-1.25 | drill 2.3 pad 3 round: M1 0,6.02; M2 0,-6.02
22-23-2051 = drill 1 long: 1 -5.08,0; 2 -2.54,0; 3 0,0; 4 2.54,0; 5 5.08,0

### Placement (x,y rotation side)
C1  66.04,26.67 180 top
C2  66.04,50.8 180 top
C3  25.4,33.97 180 top
C4  10.16,22.22 0 top
C5  10.16,41.91 0 top
C6  10.16,39.37 180 top
C7  33.02,44.13 180 top
C8  24.13,53.66 0 top
C9  24.13,24.13 90 top
C10  13.65,45.72 0 top
C11  66.04,38.1 0 top
C12  56.52,35.56 270 top
C13  60.33,36.83 0 top
C14  63.5,24.13 180 top
C15  55.88,56.52 0 top
C16  60.96,60.96 0 top
C17  66.04,46.99 180 top
C18  66.04,62.23 0 top
C19  59.05,7.62 270 top
C20  54.61,7.62 90 top
C21  41.91,22.86 180 top
C22  41.91,16.51 180 top
C23  88.9,44.45 0 top
C24  95.25,29.21 180 top
C25  95.25,31.75 180 top
C26  95.25,34.29 180 top
C27  95.25,36.83 180 top
C28  95.25,53.34 180 top
C29  95.25,55.88 180 top
C30  95.25,58.42 180 top
C31  95.25,60.96 180 top
C32  88.27,6.03 90 top
C33  49.99,7.54 270 top
D1  83.82,29.21 270 top
D2  82.55,25.4 90 top
D3  82.55,33.02 90 top
D4  83.82,36.83 270 top
D5  83.82,53.34 270 top
D6  82.55,49.53 90 top
D7  82.55,57.15 90 top
D8  83.82,60.96 270 top
H1  3.81,66.04 0 top
H2  97.79,66.04 0 top
H3  3.81,3.81 0 top
H4  97.79,3.81 0 top
IC1  66.04,31.75 270 top
IC2  17.78,24.13 180 top
IC3  66.04,55.88 270 top
IC4  24.13,44.45 0 top
IC5  78.74,17.46 0 top
L1  66.04,6.35 180 top
L2  43.18,6.35 180 top
LSP1  76.2,10.16 0 top
LSP2  81.28,10.16 0 top
R1  35.56,22.86 0 top
R2  35.56,20.32 0 top
R3  12.06,54.29 90 top
R4  57.15,29.21 270 top
R5  62.87,20.64 90 top
R6  58.42,21.59 0 top
R7  57.15,50.8 270 top
R8  66.04,43.18 90 top
R9  62.23,45.72 0 top
R10  49.85,17.46 0 top
R11  27.94,12.7 180 top
R12  27.94,15.24 0 top
R13  48.26,15.24 0 top
R14  19.37,30.8 90 top
RSX1  76.2,29.21 0 top
RSX2  76.2,34.29 0 top
RSY1  76.2,53.34 0 top
RSY2  76.2,58.42 0 top
RXLED  31.75,20.32 90 top
SV1  43.18,60.96 0 top
SV2  17.78,62.23 0 top
SW1  10.16,31.75 90 top
TP1  36.51,44.77 0 top
TP2  36.51,46.35 0 top
TP3  29.21,62.23 0 top
TP5  18.41,36.2 0 top
TP6  18.41,38.73 0 top
TXLED  31.75,22.86 90 top
X2  13.97,40.64 270 top
X3  77.47,5.08 0 top
X4  90.17,33.02 90 top
X5  90.17,57.15 90 top
X6  38.1,29.21 180 top
X7  16.51,7.62 90 top
X8  95.25,19.05 90 top

### Tracks (layer width: path | path; a pad name or v marks a point on that pad's centre or on a via)
5VRAW  (via drill 0.6 pad 1.27)
  Top 1.016: 38.1,16.51 38.1,22.86 | 38.1,22.86 v38.1,27.94 X6.2 | 38.1,22.86 C21.+ | 38.1,16.51 C22.+ | 38.1,16.51 arc90 41.91,12.7 61.18,12.7 arc-45 62.97,11.96 65.59,9.34 arc-45 66.04,8.25 arc45 66.71,6.63 arc45 67.16,6.45 68.58,6.45 arc-45 L1.1 68.58,6.31 68.58,5.08 72.39,5.08
  Top 1.27: 72.39,5.08 X3.1
+5V  (via drill 0.6 pad 1.27)
  Top 0.305: v54.61,49.53 57.15,49.53 R7.2 57.25,49.85 58.69,49.85 arc45 59.31,50.1 arc45 59.69,51.02 arc-45 60.43,52.81 60.48,52.86 arc-45 62.28,53.6 IC3.10 63.2,53.6 arc-45 64.34,53.13 arc-45 65.09,51.34 65.09,50.88 C2.2 | C1.2 65.09,26.75 65.09,28.26 63.87,29.47 IC1.10 60.62,29.47 arc45 59.48,29 arc-45 57.69,28.26 57.25,28.26 R4.2 | 65.09,41.59 65.33,41.84 arc-45 R8.1 | IC4.29 26.2,45.25 v24.13,43.18
  Top 0.406: 36.41,17.46 R2.2 R1.2 36.41,23.81 arc90 35.14,25.08 24.77,25.08 24.69,25 C9.2 24.05,25.08 20.64,25.08 20.05,25.66 IC2.4 | C10.2 15,45.25 IC4.5 22.06,45.25 v24.13,43.18 | C8.2 24.93,53.27 IC4.38 24.93,43.98 | v54.61,42.86 55.14,42.34 arc45 56.93,41.59 65.09,41.59 | v54.61,27.94 56.93,27.94 R4.2 | v24.13,43.18 24.93,43.98 | v24.13,43.18 IC4.17 24.13,34.37 C3.2 | 24.93,43.98 25.26,43.65 IC4.27 31.66,43.65 C7.2 | SV2.2 v12.7,60.96 | R3.2 12.7,55.98 12.7,58.42 | IC2.20 16.8,19.28 arc45 17.18,18.38 17.73,17.83 arc45 18.62,17.46 36.41,17.46 | 36.41,17.46 36.41,6.6 arc45 36.51,6.35 | R5.1 arc-90 60.74,17.46 56.78,17.46 arc-45 55.25,18.1 arc-45 54.61,19.63 54.61,22.12 arc45 53.87,23.92 v52.71,25.08
  Top 0.813: 12.7,59.69 12.7,58.42
  Top 1.016: v33.97,6.35 36.51,6.35 v35.56,6.35 v39.37,6.35 L2.2
  Top 1.27: v12.7,60.96 12.7,59.69
  Bottom 1.016: v54.61,49.53 v54.61,42.86 v54.61,27.94 54.61,26.99 v52.71,25.08 52.71,19.31 arc-45 52.07,17.78 41.38,7.09 arc-45 39.59,6.35 v39.37,6.35 v38.1,6.35 34.29,6.35 | 7.62,48.26 13.17,48.26 arc-45 16.7,46.8 18.86,44.64 arc45 22.39,43.18 v24.13,43.18 | 7.62,48.26 7.62,52.54 arc-45 9.08,56.07 11.24,58.23 arc45 12.7,61.76 SV2.2 | 7.62,48.26 7.62,6.35 arc90 10.16,3.81 30.38,3.81 arc45 32.18,4.55 v33.97,6.35
  pour Top: 20.32,45.4 20.32,40.96 27.62,40.96 27.62,45.4
+24V  (via drill 0.6 pad 1.27)
  Top 0.305: 82.55,52.07 82.55,52.22 D5.2 | IC3.21 71.47,57.51 72.39,58.42 72.39,60.01 72.71,60.32 82.41,60.32 D8.2 | IC3.16 71.47,54.26 72.39,53.34 72.39,51.75 72.71,51.44 82.55,51.44 82.87,51.75 | IC1.16 71.47,30.12 72.39,29.21 72.39,27.62 72.71,27.3 83.19,27.3 83.82,26.67 | IC1.21 71.47,33.38 72.39,34.29 72.39,35.88 72.71,36.2 82.23,36.2 83.03,35.4 | v68.58,38.1 C11.2
  Top 1.016: D8.2 82.72,59.52 83.82,58.42 | 83.82,58.42 83.82,58.27 D7.2 | D5.2 82.72,51.9 82.87,51.75 83.82,50.8 | 83.82,50.8 83.82,50.65 D6.2 | D1.2 82.72,28.09 83.82,26.99 83.82,26.67 83.82,26.52 D2.2 83.97,26.67 v86.36,26.67 | D4.2 82.72,35.71 83.03,35.4 83.82,34.61 83.82,34.14 D3.2 83.97,34.29 v86.36,34.29 | v68.58,62.23 C18.2 | v86.36,58.42 83.82,58.42 | v86.36,50.8 83.82,50.8
  Bottom 1.016: 86.36,38.1 v86.36,34.29 arc-45 86.99,32.76 86.99,28.2 arc-45 v86.36,26.67 89.96,24.43 | v68.58,62.23 arc-90 70.8,64.45 81.36,64.45 arc-90 86.36,59.45 v86.36,58.42 86.57,58.21 arc-45 87.31,56.41 87.31,52.8 arc-45 86.57,51.01 v86.36,50.8 C23.+ 86.36,38.1 | 86.36,38.1 v68.58,38.1 | 92.39,8.89 92.39,21.52 arc58 91.19,23.68 89.96,24.43 | IC5.10 89.59,21.27 arc-45 90.04,21.09 90.8,20 90.8,8.36 arc-45 90.06,6.56 88.27,4.76 C32.+ | X8.5 90.7,24.13 arc-45 89.96,24.43
  Bottom 1.27: 92.39,8.89 92.39,7.72 arc-45 91.65,5.92 89.4,3.68 arc-45 88.95,3.49 C32.+ 83.92,3.49 arc-45 82.12,4.24 X3.4
CTS#  (via drill 0.6 pad 1.27)
  Top 0.406: IC4.14 21.73,35.7 v21.27,35.24 | IC2.11 15.5,28.95 arc-45 15.88,29.85 v16.51,30.48
  Bottom 0.61: v16.51,30.48 v21.27,35.24
DISPLAY#  (via drill 0.6 pad 1.27)
  Top 0.406: v25.4,60.96 SV2.7 | IC4.44 20.13,54.64 arc-45 20.87,56.43 24.13,59.69
  Top 0.61: 24.13,59.69 v25.4,60.96
FTDIRESET
  Top 0.305: 28.99,13.14 R11.1
  Top 0.406: 28.99,13.14 R12.1 18.83,15.24 arc-45 17.04,15.98 16.9,16.12 arc-45 16.16,17.92 IC2.19
GND  (via drill 0.6 pad 1.27)
  Top 0.305: C17.1 C2.1 66.91,52.14 67.08,52.3 | C15.1 54.78,58.59 v54.93,58.74 | IC1.24 68.03,35.32 66.36,33.66 66.36,32.07 IC1.THERMALPAD 66.04,30.16 66.67,29.53 | IC1.13 68.03,28.18 66.67,29.53 | C1.1 66.91,29.29 66.67,29.53 | R6.1 57.27,19.39 | C12.1 v56.52,38.42 | 30.8,44.45 30.98,44.45 arc90 31.11,44.58 arc-45 31.25,44.9 arc-45 31.7,45.09 33.02,45.09
  Top 0.406: IC2.21 17.45,23.8 v17.78,24.13 | 18.11,24.45 18.43,24.13 19.37,24.13 20.32,23.18 20.32,22.86 | v17.78,24.13 16.51,24.13 15.5,23.12 IC2.18 | IC2.26 IC2.25 20.32,20.77 20.32,22.86 | C6.2 9.06,40.64 | 9.06,40.64 C5.1 | 9.06,40.64 v9.21,40.64 | IC4.6 13.33,44.45 12.7,45.09 12.7,45.64 | 12.7,45.64 C10.1 | 12.7,45.64 11.19,45.64 v11.11,45.72 | IC4.39 24.13,51.02 arc45 23.39,52.81 23.25,52.95 C8.1 | IC3.13 67.08,52.3 66.04,53.34 v66.04,53.98 IC3.THERMALPAD v66.04,57.78 66.04,58.42 67.08,59.45 IC3.24 | 23.18,53.34 23.18,53.66 arc-90 v25.08,55.56 | R12.2 31.43,15.24 v31.75,14.92 | C4.1 9.29,22.73 arc-45 9.66,23.63 v10.16,24.13 SW1.P$1 | C9.1 20.71,23.25 20.32,22.86 | 18.11,24.45 IC2.7 | v17.78,24.13 18.11,24.45 | IC4.28 30.8,44.45 | v34.93,44.13 C7.1 33.9,44.45 arc90 33.26,45.09 33.02,45.09 | IC4.18 24.93,36.77 arc45 25.67,34.97 26.27,34.37 C3.1 26.35,33.9 v26.35,32.38 | C27.1 C26.1 C25.1 C24.1
  Top 0.61: C8.1 23.18,53.34
  Top 1.016: D6.1 83.65,46.52 v83.82,46.35 | D5.1 82.72,55.27 | 82.72,55.27 D7.1 | v85.09,55.24 82.69,55.24 82.72,55.27 | RSY1.2 79.69,53.34 80.33,52.7 | RSY2.2 79.69,58.42 80.33,59.05 | 83.65,31.09 D3.1 | D1.1 83.65,31.09 | D4.1 82.72,39.84 v82.55,40.01 | RSX2.2 78.42,34.29 78.74,34.61 78.42,34.92 v80.64,34.92 | v80.33,28.57 79.03,28.57 RSX1.2 | D2.1 arc109 84.92,23.98 v85.09,23.81 | 83.65,31.09 85.38,31.09 v85.41,31.11 | C22.- C21.- 43.96,25.89 X6.1 | 55.71,9.67 C19.- | 55.71,9.67 55.25,9.21 C20.2 | v54.61,9.84 55.54,9.84 55.71,9.67 | v80.01,62.23 82.4,62.23 D8.1
  other vias: 66.04,55.88 58.74,44.13 66.04,31.75 66.04,33.66 66.04,29.84 55.88,24.77 17.78,9.21 96.52,50.8 96.52,26.67 48.58,51.12 43.5,43.5 56.83,47.94 76.2,58.42 76.2,53.66 45.09,19.37
  pour Bottom (isolate 0.61): 1.27,82.55 1.27,1.27 100.33,1.27 100.33,82.55
  pour Top (isolate 0.61): 0,69.85 0,0 100.33,0 100.33,69.85
MENABLE  (via drill 0.6 pad 1.27)
  Top 0.305: IC3.23 69.6,58.8 70.48,59.69 | IC1.23 69.92,34.67 70.48,35.24 v70.48,46.99
  Top 0.406: 70.48,59.69 70.48,60.64 v72.07,62.23 70.28,64.03 arc45 68.48,64.77 36.61,64.77 arc45 34.82,64.03 arc45 34.29,62.76 34.29,60.74 arc-45 33.55,58.95 32.49,57.89 arc-45 30.7,57.15 25.18,57.15 arc45 23.39,56.41 22.65,55.67 arc45 21.91,53.88 21.91,53.76 arc45 22.65,51.96 23.33,51.28 IC4.40
  Bottom 0.61: v72.07,62.23 arc90 70.48,60.64 v70.48,46.99
MISO  (via drill 0.6 pad 1.27)
  Top 0.406: v15.24,60.96 SV2.3 | IC4.2 18.17,47.65 arc-45 16.38,48.39 15.98,48.79 arc-45 15.24,50.58 15.24,58.42
  Top 0.813: 15.24,58.42 15.24,59.69
  Top 1.27: 15.24,59.69 v15.24,60.96
MOSI  (via drill 0.6 pad 1.27)
  Top 0.406: IC4.1 18.33,54.11 arc-45 19.07,55.9 21.59,58.42 | v22.86,60.96 SV2.6
  Top 0.61: 21.59,58.42 22.12,58.95 arc45 22.86,60.74 v22.86,60.96
MRESET  (via drill 0.6 pad 1.27)
  Top 0.305: 59.57,54.81 arc-45 61.37,55.55 IC3.7 | IC1.7 53.35,31.43 53.34,31.43 v48.58,31.43
  Top 0.406: v21.27,46.67 20.99,46.7 arc45 21.73,48.5 IC4.42 | v48.58,46.04 48.58,47.21 arc-45 49.32,49 52.91,52.6 arc-45 54.71,53.34 57.05,53.34 arc45 58.85,54.08 59.57,54.81
  Bottom 0.305: v21.27,46.67 21.27,46.04
  Bottom 0.61: v48.58,31.43 v48.58,46.04 21.27,46.04
MSLEEP  (via drill 0.6 pad 1.27)
  Top 0.305: IC3.9 61.98,54.26 arc45 60.18,53.51 59.41,52.74 arc45 58.74,51.12 58.42,50.8 | IC1.9 60.39,30.12 arc45 58.59,29.38 arc-45 58.18,29.21 v50.8,29.21
  Top 0.406: v23.5,47.62 23.27,47.85 arc-45 22.53,49.64 IC4.41 | 58.42,50.8 54.39,50.8 arc45 52.6,50.06 51.25,48.71 arc45 v50.8,47.62
  Bottom 0.61: v50.8,29.21 v50.8,47.62 v23.5,47.62
N$1
  Top 0.305: IC2.22 18.11,19.68 arc90 19.38,18.41 28.05,18.41 arc45 28.95,18.79 29.21,19.05
  Top 0.406: 29.21,19.05 30.11,19.95 arc-45 RXLED.C
N$2
  Top 0.406: TXLED.A R1.1
N$3
  Top 0.406: RXLED.A R2.1
N$4
  Top 0.406: C6.1 12.13,38.5 X2.P$2 13.97,38.95 arc-45 14.71,40.75 15.69,41.72 arc45 15.88,42.17 15.88,42.21 arc-90 16.51,42.85 IC4.8
N$5  (via drill 0.6 pad 1.27)
  other vias: 17.78,60.96
N$6  (via drill 0.6 pad 1.27)
  other vias: 20.32,60.96
N$7
  Top 0.406: IC2.17 14.86,21.97 14.61,22.22 C4.2
N$8
  Top 0.406: X2.P$1 14.37,42.38 | X2.P$1 12.13,42.78 C5.2 | IC4.7 14.84,43.65 X2.P$1
N$9  (via drill 0.6 pad 1.27)
  other vias: 35.56,27.94
N$10
  Top 0.305: IC1.3 60.64,34.02 arc-90 58.1,36.56 58.1,37.68 arc-45 58.18,37.86 58.42,38.1 C11.1
N$11
  Top 0.406: R6.3 arc-45 59.63,18.99 62.23,21.59 62.63,21.59 arc45 R5.2
N$12
  Top 0.305: C12.2 56.86,34.12 arc45 58.65,33.38 IC1.4
N$13
  Top 0.305: IC2.23 18.75,19.68 arc90 19.39,19.05 26.14,19.05 arc45 27.04,19.42 27.94,20.32
  Top 0.406: 27.94,20.32 30.11,22.49 arc-45 TXLED.C
N$14
  Top 0.305: R4.1 arc-45 58.39,30.77 IC1.8
N$15
  Top 0.305: C13.1 60.45,35.1 arc55 61.26,34.67 IC1.2
N$16
  Top 0.305: IC1.1 63.12,35.48 arc45 62.8,36.26 arc45 C13.2
N$17
  Top 0.406: IC4.10 17.85,41.25 arc45 17.14,40.96 17.14,34.96 arc45 17.89,33.17 R14.2
N$18
  Top 0.305: IC1.17 72.44,30.77 RSX1.1
N$19
  Top 0.305: IC1.20 72.44,32.73 RSX2.1
N$20
  Top 0.305: C15.2 57.37,56.52 arc45 59.16,57.26 arc-45 59.76,57.51 IC3.4
N$21
  Top 0.305: IC3.8 61.67,54.91 arc45 59.88,54.16 57.79,52.07 57.37,52.07 R7.1
N$22
  Top 0.305: IC3.2 62.45,58.8 arc-68 60.1,60.38 C16.1
N$23
  Top 0.305: IC3.1 arc45 62.69,60.5 62.23,60.96 C16.2
N$25
  Top 0.406: R8.2 64.64,44.23 R9.3
N$26
  Top 0.305: IC3.17 72.44,54.91 RSY1.1
N$27
  Top 0.305: IC3.20 72.44,56.85 RSY2.1
N$28
  Top 0.305: IC3.3 61.01,58.16 arc-45 59.21,58.9 59.16,58.95 arc-45 58.42,60.74 58.42,61.23 arc-90 59.42,62.23 C18.1
N$29
  Top 1.016: 54.61,5.57 C19.+ 63.15,5.57 arc45 63.5,5.71 63.5,6.25 arc-45 L1.2 | 54.61,5.57 C20.1 | 54.61,5.57 50.17,5.57 arc45 C33.+ 46.27,5.49 arc45 46.04,5.4 46.04,5.49 arc45 L2.1
N$30  (via drill 0.6 pad 1.27)
  other vias: 40.64,27.94
N$31  (via drill 0.6 pad 1.27)
  other vias: 73.66,3.81
N$32  (via drill 0.6 pad 1.27)
  other vias: 96.52,13.97
N$33  (via drill 0.6 pad 1.27)
  other vias: 96.52,16.51
N$34  (via drill 0.6 pad 1.27)
  other vias: 96.52,19.05
N$35  (via drill 0.6 pad 1.27)
  other vias: 91.44,29.21
N$36  (via drill 0.6 pad 1.27)
  other vias: 91.44,31.75
N$37  (via drill 0.6 pad 1.27)
  other vias: 91.44,36.83
N$38  (via drill 0.6 pad 1.27)
  other vias: 91.44,53.34
N$39  (via drill 0.6 pad 1.27)
  other vias: 91.44,55.88
N$40  (via drill 0.6 pad 1.27)
  other vias: 91.44,60.96
N$41
  Top 0.406: X8.1 92.97,13.97 arc-45 92.52,14.16 90.91,15.77 arc45 89.12,16.51 75.35,16.51 arc-45 73.55,17.25 71.31,19.5 arc-45 71.12,19.95 IC5.17 IC5.18
N$42  (via drill 0.6 pad 1.27)
  Top 0.406: v18.73,12.38 18.68,12.33 X7.1 26,12.33 arc45 R11.2
N$43
  Top 0.406: X8.2 92.02,16.51 arc-45 91.57,16.7 90.99,17.28 arc45 90.54,17.46 79.79,17.46 arc-45 78,18.21 76.39,19.82 arc-45 76.2,20.27 IC5.15 IC5.16
N$44
  Top 0.406: X8.3 91.7,19.05 arc45 91.25,18.86 90.99,18.6 arc-45 90.54,18.41 83.92,18.41 arc-45 82.12,19.16 81.47,19.82 arc-45 81.28,20.27 IC5.13 IC5.14
N$45
  Top 0.406: X8.4 92.97,21.59 arc45 92.52,21.4 91.23,20.11 arc-45 89.44,19.37 87.26,19.37 arc-45 86.81,19.55 86.36,20 IC5.11 IC5.12
N$46
  Top 0.406: IC5.2 IC5.1 68.45,13.78 arc45 68,13.97 51.85,13.97 arc-45 50.06,14.71 49.69,15.08 arc45 R13.2
N$47
  Top 0.406: R10.2 arc-45 51.27,17.31 52.91,15.67 arc45 54.71,14.92 65.74,14.92 arc45 66.25,15.13 arc-45 68.05,15.88 71.66,15.88 arc-45 73.45,15.13 73.66,14.92 IC5.3 IC5.4
N$48
  Top 0.406: IC5.5 IC5.6
  Top 0.61: LSP1.MP 79.06,13.02 79.06,13.07 arc45 78.87,13.52 IC5.5
N$49
  Top 0.406: IC5.7 IC5.8
  Top 0.61: LSP2.MP 83.82,12.7 IC5.7
N$50  (via drill 0.6 pad 1.27)
  other vias: 96.52,21.59
N$51  (via drill 0.6 pad 1.27)
  other vias: 96.52,24.13
PA6
  Top 0.406: IC4.31 35.32,46.85 arc-45 TP2.TP
PA7
  Top 0.406: TP1.TP 36.2,44.77 35.66,45.31 arc45 33.86,46.05 IC4.30
PB3
  Top 0.406: IC4.43 20.93,54.17 arc-45 21.67,55.96 23.39,57.68 arc-45 25.18,58.42 25.62,58.42 arc45 27.41,59.16 28.47,60.22 arc45 29.21,62.01 TP3.PP
PD2
  Top 0.406: IC4.11 18.33,38.82 TP6.TP
PD3
  Top 0.406: TP5.TP 18.41,36.51 20.13,38.23 IC4.12
PD7
  Top 0.406: IC4.16 23.33,33.39 arc45 23.7,32.5 25.66,30.53 arc45 26.56,30.16 30.91,30.16 arc45 31.8,30.53 33.86,32.59 arc-45 35.66,33.34 40.22,33.34 arc-45 42.02,32.59 48.15,26.46 arc-45 48.9,24.66 48.9,17.7 arc-45 R10.1
PENPULSE
  Top 0.406: IC4.15 22.53,32.92 arc45 22.9,32.02 25.29,29.64 arc45 27.09,28.89 34.98,28.89 arc45 35.43,29.08 X6.3 35.56,30.53 arc-45 35.75,30.98 36.4,31.64 arc-45 38.2,32.38 39.59,32.38 arc-45 41.38,31.64 46.56,26.46 arc-45 47.31,24.66 47.31,15.48 arc-45 R13.1
RESET
  Top 0.305: 11.43,59.69 11.43,64.14
  Top 0.406: 11.43,64.14 12.27,64.98 arc-45 14.07,65.72 17.05,65.72 arc-45 18.84,64.98 20.32,63.5 SV2.5 | 12.06,50.16 15.44,46.79 arc45 17.23,46.05 IC4.4 | 12.06,50.16 8.36,46.46 arc45 7.62,44.67 7.62,38.63 arc45 7.99,37.73 10.16,35.56 SW1.P$2 | 12.06,50.16 arc45 12.7,51.7 12.7,52.61 R3.1 | 12.06,50.16 10.9,51.33 arc-45 10.16,53.12 10.16,55.14 arc-45 10.69,56.41 arc45 11.43,58.2 11.43,59.69
RTS#
  Top 0.406: IC2.3 20.7,26.29 20.95,26.04 22.22,26.04 arc90 23.5,27.3 23.5,29.64 arc45 23.12,30.53 20.38,33.28 arc-45 20,34.18 20,35.99 arc-45 20.38,36.88 20.56,37.07 arc45 20.93,37.97 IC4.13
RXD
  Top 0.406: IC4.9 17.55,42.05 arc45 17.1,41.86 16.38,41.14 arc45 16.19,40.69 16.19,33.91 arc45 16.94,32.12 17.51,31.54 arc45 19.31,30.8 19.37,30.8 arc-45 21.16,30.05 21.26,29.96 arc-45 22,28.16 IC2.1
SCK
  Top 0.305: 13.97,59.69 13.97,63.28 arc-90 15.46,64.77
  Top 0.406: SV2.4 17.78,63.5 17.25,64.03 arc45 15.46,64.77 | IC4.3 17.7,46.85 arc-45 15.91,47.59 14.71,48.79 arc-45 13.97,50.58 13.97,59.69
TXD
  Top 0.406: IC2.5 19.41,29.5 arc45 R14.1
U+  (via drill 0.6 pad 1.27)
  Top 0.406: IC2.15 13.55,11.43 arc90 14.82,10.16 15.09,10.16 | 15.09,10.16 X7.3 | 15.09,10.16 15.09,9.57 arc45 v15.24,9.21
U-  (via drill 0.6 pad 1.27)
  Top 0.305: X7.2 15.24,12.35
  Top 0.406: 15.24,12.35 v15.24,13.34 15.24,17.25 arc45 14.87,18.15 14.58,18.44 arc-45 14.21,19.34 IC2.16
VREFX
  Top 0.305: 61.7,26.76 61.92,26.98 IC1.12 | 62.42,24.34 C14.2
  Top 0.4: 61.92,26.98 60.65,25.7 61.74,24.62 arc45 62.42,24.34
  Top 0.406: 60.65,25.7 arc-45 60.59,25.56 R6.2
VREFY
  Top 0.305: IC3.12 63.12,49.67 arc-32 62.73,48.32 R9.2 62.23,47.62 62.76,47.73 arc45 64.55,46.99 C17.2
X1A
  Top 0.305: IC1.18 79.38,31.43 81.6,29.21 D1.3
  Top 0.406: D1.3 87.63,29.21
  Top 0.61: X4.1 C24.2
  Top 0.813: 87.63,29.21 X4.1
X1B  (via drill 0.6 pad 1.27)
  Top 0.305: IC1.15 70.85,29.47 71.44,28.89 71.44,26.99
  Top 0.406: 71.44,26.99 72.28,26.14 arc45 74.08,25.4 D2.3 89.12,25.4 arc45 90.91,26.14 arc-45 92.18,26.67 92.93,26.67 arc45 94.72,27.41 arc45 95.25,28.68 95.25,32.93 arc45 95.06,33.38 C26.2 | v91.44,34.29 X4.3
  Top 0.61: C26.2 v91.44,34.29
X2A
  Top 0.305: IC1.19 80.5,32.08 D3.3
  Top 0.406: D3.3 85.46,33.02 arc-45 86.99,32.38
  Top 0.61: X4.2 C25.2
  Top 0.813: 86.99,32.38 arc45 88.53,31.75 X4.2
X2B
  Top 0.305: IC1.22 70.85,34.02 71.44,34.61 71.44,36.51 71.75,36.83 D4.3
  Top 0.406: D4.3 87.63,36.83
  Top 0.61: X4.4 C27.2
  Top 0.813: 87.63,36.83 X4.4
XDIR
  Top 0.305: IC1.14 69.92,28.82 70.48,28.26
  Top 0.406: IC4.19 25.73,37.55 arc45 26.47,35.76 27.2,35.03 arc45 28.99,34.29 41.38,34.29 arc-45 42.28,33.92 50.06,26.14 arc-45 50.8,24.35 50.8,21.69 arc45 51.54,19.89 54.18,17.25 arc45 55.98,16.51 61.5,16.51 arc45 63.29,17.25 64.03,17.99 arc45 64.77,19.79 64.77,20.22 arc-45 65.51,22.02 69.74,26.24 arc45 70.48,28.04 70.48,28.26
XINF  (via drill 0.6 pad 1.27)
  Top 0.406: IC4.36 26.53,50.88 arc-45 27.27,52.67 arc-45 28.88,53.34 31.97,53.34 arc45 33.76,54.08 35.56,55.88 | SV1.3 v38.74,58.74
  Top 0.813: 35.56,55.88 SV1.3
XMS1
  Top 0.305: IC1.5 54.69,32.73 arc-45 52.89,33.47 52.07,34.29
  Top 0.406: IC4.22 28.68,38.1 47.21,38.1 arc-45 49,37.36 52.07,34.29
XMS2
  Top 0.305: 27.3,38.62 IC4.21 | IC1.6 54.07,32.08 arc-45 52.27,32.82 52.07,33.02
  Top 0.406: 27.3,38.62 27.3,37.78 27.51,37.57 arc45 29.31,36.83 47.21,36.83 arc-45 49,36.09 52.07,33.02
XSTEP
  Top 0.305: 59.83,28.08 arc-45 61.63,28.82 IC1.11
  Top 0.406: IC4.20 26.53,37.91 arc45 27.2,36.3 arc45 28.99,35.56 41.38,35.56 arc-45 42.28,35.19 50.06,27.41 arc45 51.85,26.67 57.37,26.67 arc45 59.16,27.41 59.83,28.08
XSUP  (via drill 0.6 pad 1.27)
  Top 0.406: IC4.37 25.73,51.35 arc-45 26.47,53.14 27.2,53.87 arc-45 28.99,54.61 30.7,54.61 arc45 32.49,55.35 34.29,57.15 | SV1.1 v36.2,58.74
  Top 0.813: 34.29,57.15 SV1.1
Y1A
  Top 0.305: IC3.18 70.17,55.55 70.18,55.56 79.38,55.56 81.6,53.34 D5.3
  Top 0.406: D5.3 87.63,53.34
  Top 0.61: X5.1 C28.2
  Top 0.813: 87.63,53.34 X5.1
Y1B  (via drill 0.6 pad 1.27)
  Top 0.305: IC3.15 70.85,53.6 71.44,53.02 71.44,51.44
  Top 0.406: v91.44,58.42 X5.3 | 71.44,51.44 72.6,50.27 arc45 74.39,49.53 D6.3 91.66,49.53 arc45 93.45,50.27 95.25,52.07 95.25,57.06 arc45 95.06,57.51 C30.2
  Top 0.61: C30.2 v91.44,58.42
Y2A
  Top 0.305: IC3.19 79.38,56.2 80.33,57.15 D7.3
  Top 0.406: D7.3 85.78,57.15 arc-45 87.31,56.52
  Top 0.61: 87.31,56.52 87.95,55.88 | X5.2 C29.2
  Top 0.813: 87.95,55.88 X5.2
Y2B
  Top 0.305: IC3.22 70.54,58.16 71.44,59.05 71.44,60.01 72.39,60.96 D8.3
  Top 0.406: D8.3 87.63,60.96
  Top 0.61: X5.4 C31.2
  Top 0.813: 87.63,60.96 X5.4
YDIR
  Top 0.305: IC3.14 70.23,52.95 70.48,52.7 70.48,51.53 arc-45 69.74,49.74 69.32,49.32 arc45 68.58,47.52 68.58,42.96 arc-45 67.84,41.17
  Top 0.406: IC4.23 66.11,40.45 arc45 67.84,41.17
YINF  (via drill 0.6 pad 1.27)
  Top 0.406: SV1.7 v43.82,58.74 | IC4.34 33.96,50.25 arc45 35.75,50.99 40.64,55.88
  Top 0.813: 40.64,55.88 SV1.7
YMS1
  Top 0.305: IC3.5 60.77,56.85 arc45 58.97,56.11 58.53,55.67 arc-45 56.73,54.93 49.85,54.93 | 49.85,54.93 49.21,54.93 | 46.04,52.39 47.83,54.18 arc-45 49.63,54.93 49.85,54.93
  Top 0.406: IC4.26 35.45,42.85 arc45 37.24,43.59 46.04,52.39
YMS2
  Top 0.305: IC3.6 61.07,56.2 arc45 59.27,55.46 58.85,55.04 arc-45 57.05,54.29 50.27,54.29 arc45 48.47,53.55 46.99,52.07
  Top 0.406: IC4.25 35.92,42.05 arc45 37.71,42.79 46.99,52.07
YSTEP
  Top 0.305: IC3.11 62.58,52.95 arc45 60.78,52.21 arc45 60.33,51.1 60.33,49.79 arc-45 59.69,48.26
  Top 0.406: IC4.24 47.82,41.25 arc45 49.61,41.99 52.6,44.98 arc-45 54.39,45.72 56.1,45.72 arc45 57.89,46.46 59.69,48.26
YSUP  (via drill 0.6 pad 1.27)
  Top 0.406: IC4.35 27.33,51.46 arc-45 28.8,52.07 33.24,52.07 arc45 35.03,52.81 39.37,57.15 | SV1.5 v41.28,58.74
  Top 0.813: 39.37,57.15 SV1.5
ZINF  (via drill 0.6 pad 1.27)
  Top 0.406: SV1.11 v48.9,58.74 | IC4.32 36.44,47.65 arc45 38.23,48.39 45.72,55.88
  Top 0.813: 45.72,55.88 SV1.11
ZSUP  (via drill 0.6 pad 1.27)
  Top 0.406: SV1.9 v46.36,58.74 | IC4.33 34.7,48.45 arc45 36.49,49.19 44.45,57.15
  Top 0.813: 44.45,57.15 SV1.9

### Text on the board
Top: Y AXIS | X AXIS | SVO 2009 | REV/B | MOTÖRI